# EAGLE schematic ESC_NoPilot (EAGLE 6.2)
AUTHOR: Kjell H Andersen; PROJECT_NAME: NoPilot; REVISION: 1.0

## Sheet 1 of 3
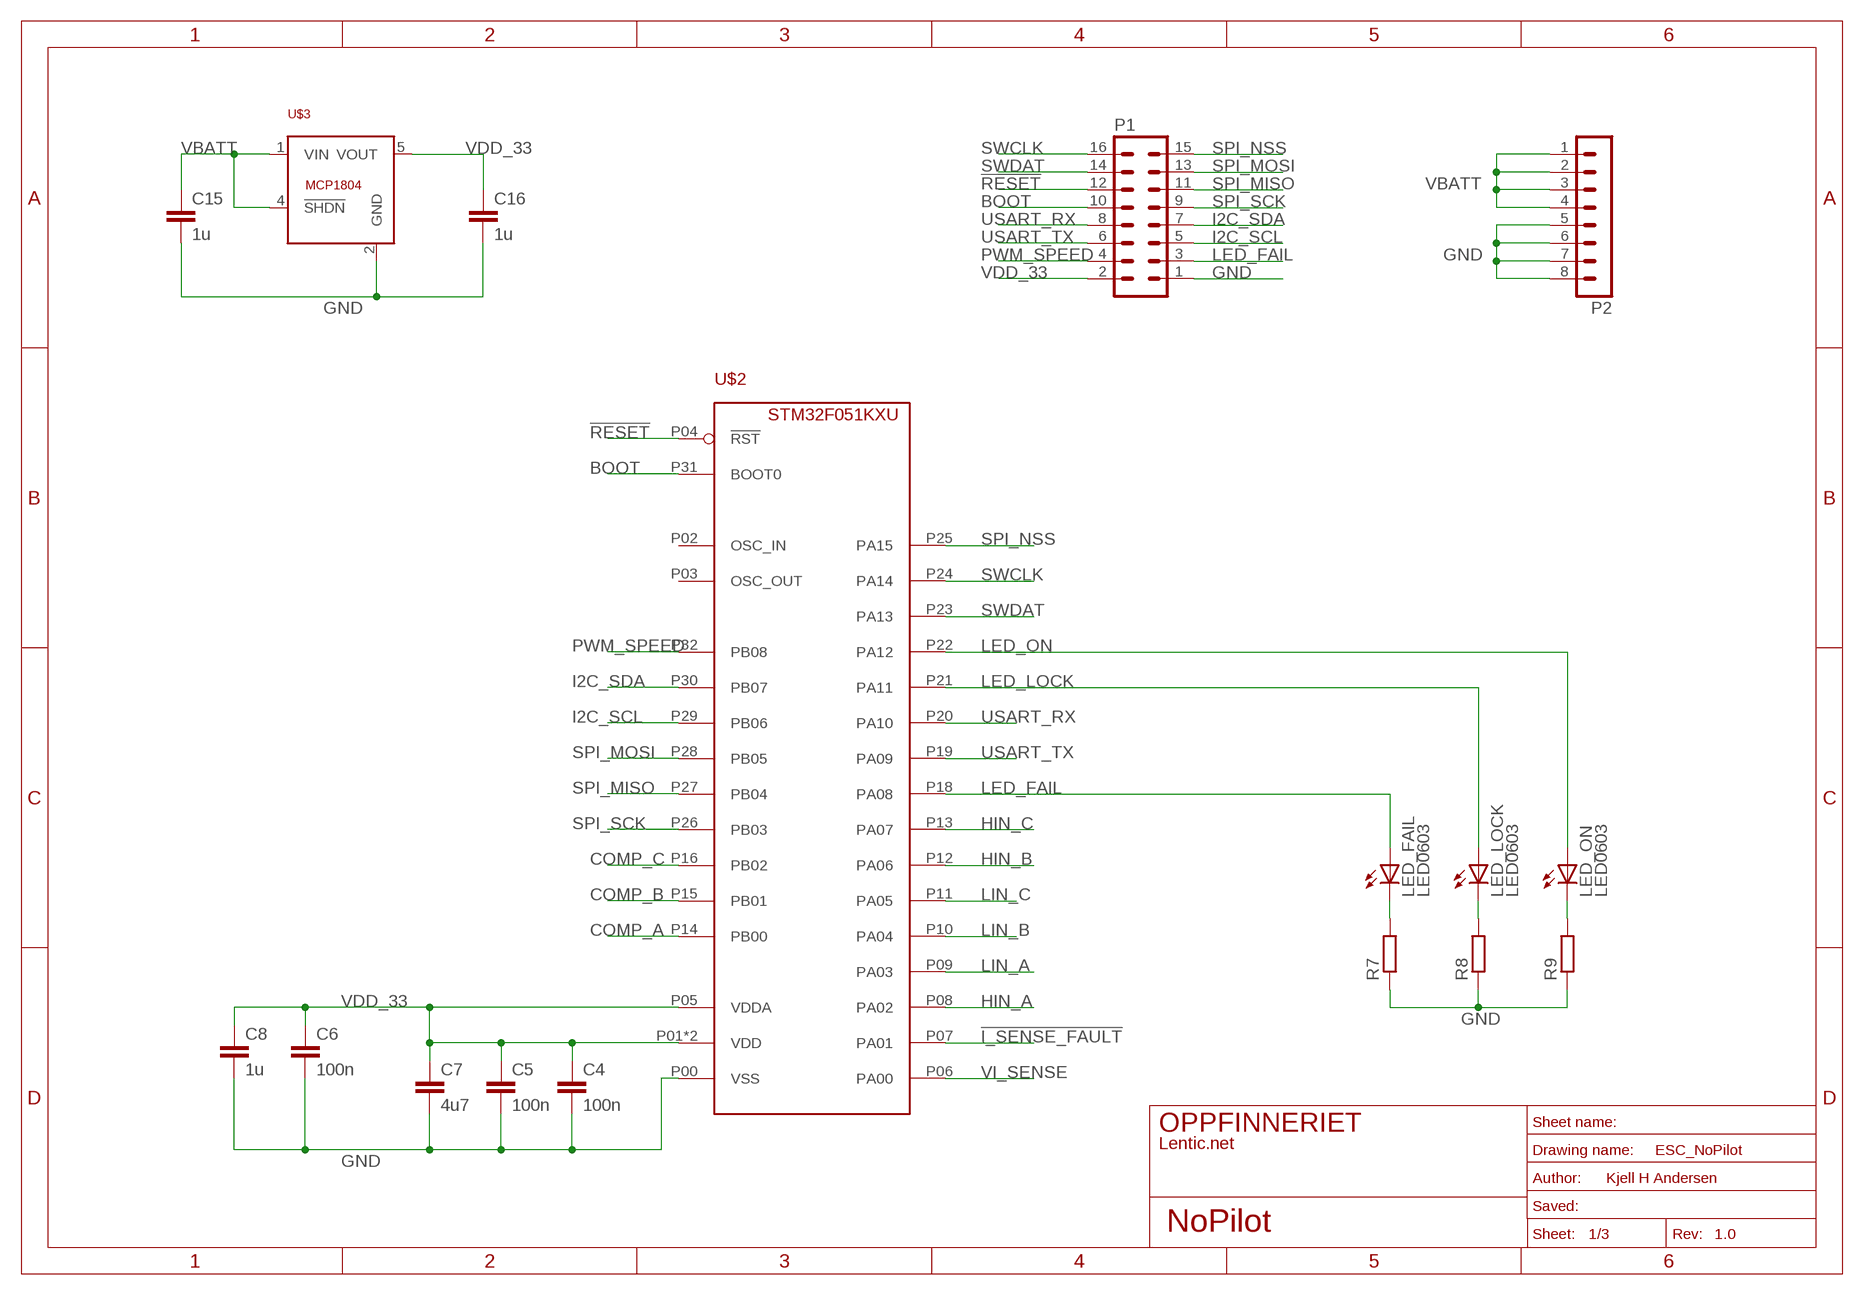
[diagram p0: schematic, sheet 1]
U$1 (A4_L): SHEET_NAME: MCU

### Parts
C4  100n  C-EUC0402  [C0402]
C5  100n  C-EUC0402  [C0402]
C6  100n  C-EUC0402  [C0402]
C7  4u7  C-EUC0805  [C0805]
C8  1u  C-EUC0805  [C0805]
C15  1u  C-EUC0805  [C0805]
C16  1u  C-EUC0805  [C0805]
LED_FAIL  LED0603  [D0603]
LED_LOCK  LED0603  [D0603]
LED_ON  LED0603  [D0603]
P1  MA08-2  [MA08-2]
P2  MA08-1  [MA08-1]
R7  R-EU_R0402  [R0402]
R8  R-EU_R0402  [R0402]
R9  R-EU_R0402  [R0402]
U$2  STM32F051KXU  [UFQFPN32]
U$3  MCP1804  [SOT23]

### Nets
!I_SENSE_FAULT: U$2.P07(PA01) ; also sheet 3
!RESET: P1.12 U$2.P04(!RST)
BOOT: P1.10 U$2.P31(BOOT0)
COMP_A: U$2.P14(PB00) ; also sheet 3
COMP_B: U$2.P15(PB01) ; also sheet 3
COMP_C: U$2.P16(PB02) ; also sheet 3
GND: C4.2 C5.2 C6.2 C7.2 C8.2 C15.2 C16.2 P1.1 P2.5 P2.6 P2.7 P2.8 R7.1 R8.1 R9.1 U$2.P00(VSS) U$3.2(GND) ; also sheet 2,3
HIN_A: U$2.P08(PA02) ; also sheet 2
HIN_B: U$2.P12(PA06) ; also sheet 2
HIN_C: U$2.P13(PA07) ; also sheet 2
I2C_SCL: P1.5 U$2.P29(PB06)
I2C_SDA: P1.7 U$2.P30(PB07)
LED_FAIL: LED_FAIL.A P1.3 U$2.P18(PA08)
LED_LOCK: LED_LOCK.A U$2.P21(PA11)
LED_ON: LED_ON.A U$2.P22(PA12)
LIN_A: U$2.P09(PA03) ; also sheet 2
LIN_B: U$2.P10(PA04) ; also sheet 2
LIN_C: U$2.P11(PA05) ; also sheet 2
N$5: LED_FAIL.C R7.2
N$6: LED_LOCK.C R8.2
N$7: LED_ON.C R9.2
PWM_SPEED: P1.4 U$2.P32(PB08)
SPI_MISO: P1.11 U$2.P27(PB04)
SPI_MOSI: P1.13 U$2.P28(PB05)
SPI_NSS: P1.15 U$2.P25(PA15)
SPI_SCK: P1.9 U$2.P26(PB03)
SWCLK: P1.16 U$2.P24(PA14)
SWDAT: P1.14 U$2.P23(PA13)
USART_RX: P1.8 U$2.P20(PA10)
USART_TX: P1.6 U$2.P19(PA09)
VBATT: C15.1 P2.1 P2.2 P2.3 P2.4 U$3.1(VIN) U$3.4(!SHDN) ; also sheet 2,3
VDD_33: C4.1 C5.1 C6.1 C7.1 C8.1 C16.1 P1.2 U$2.P01(VDD) U$2.P05(VDDA) U$2.P17(VDD) U$3.5(VOUT) ; also sheet 3
VI_SENSE: U$2.P06(PA00) ; also sheet 3
Unconnected: U$2.P02(OSC_IN) U$2.P03(OSC_OUT)

## Sheet 2 of 3
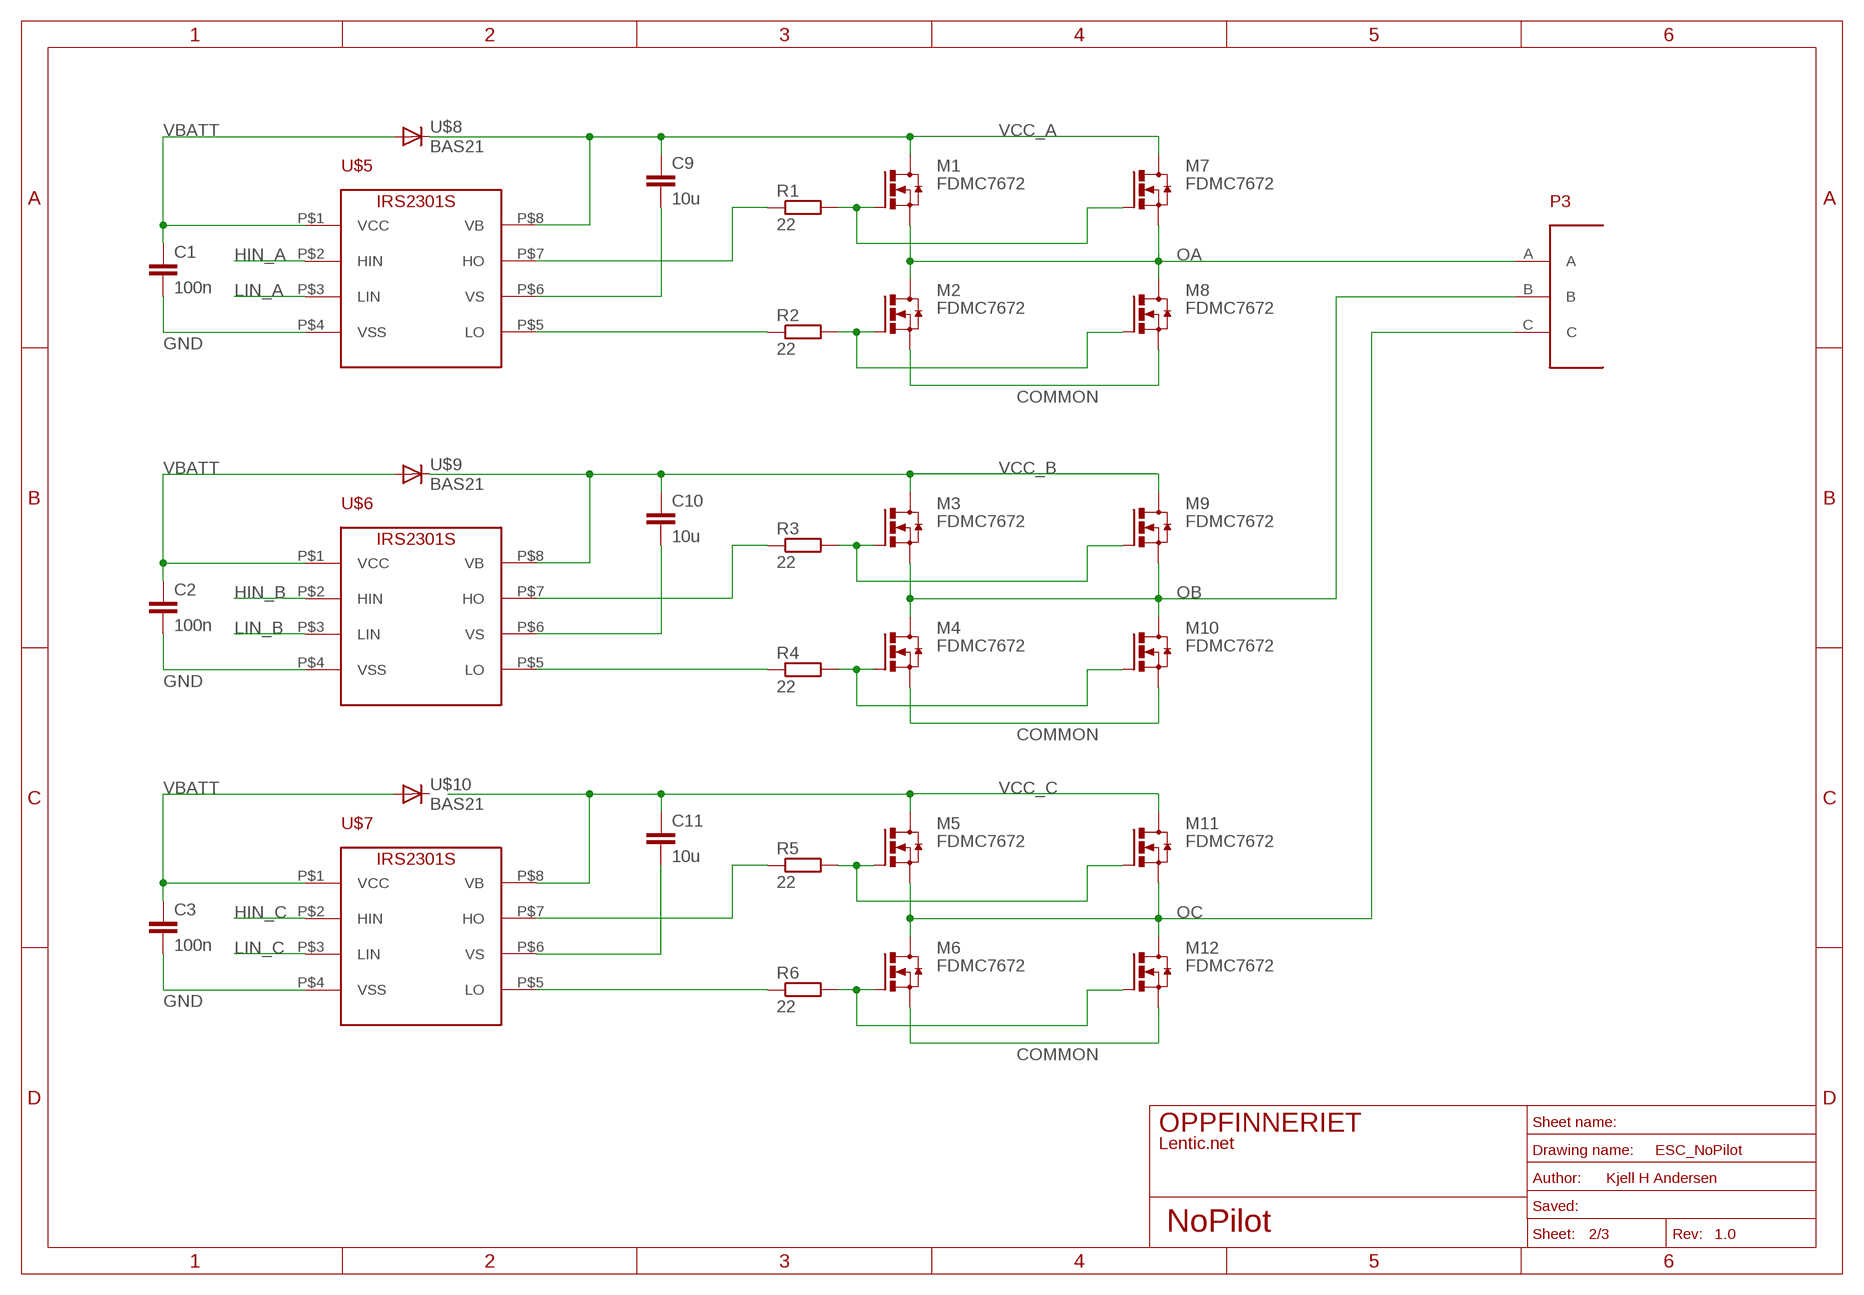
[diagram p1: schematic, sheet 2]
U$4 (A4_L): SHEET_NAME: Driver

### Parts
C1  100n  C-EUC0402  [C0402]
C2  100n  C-EUC0402  [C0402]
C3  100n  C-EUC0402  [C0402]
C9  10u  C-EUC0805  [C0805]
C10  10u  C-EUC0805  [C0805]
C11  10u  C-EUC0805  [C0805]
M1  FDMC7672  [MLP_3P3X3P3]
M2  FDMC7672  [MLP_3P3X3P3]
M3  FDMC7672  [MLP_3P3X3P3]
M4  FDMC7672  [MLP_3P3X3P3]
M5  FDMC7672  [MLP_3P3X3P3]
M6  FDMC7672  [MLP_3P3X3P3]
M7  FDMC7672  [MLP_3P3X3P3]
M8  FDMC7672  [MLP_3P3X3P3]
M9  FDMC7672  [MLP_3P3X3P3]
M10  FDMC7672  [MLP_3P3X3P3]
M11  FDMC7672  [MLP_3P3X3P3]
M12  FDMC7672  [MLP_3P3X3P3]
P3  3PH_SJ  [3PH_SJ]
R1  22  R-EU_R0402  [R0402]
R2  22  R-EU_R0402  [R0402]
R3  22  R-EU_R0402  [R0402]
R4  22  R-EU_R0402  [R0402]
R5  22  R-EU_R0402  [R0402]
R6  22  R-EU_R0402  [R0402]
U$5  IRS2301S  [SOIC8]
U$6  IRS2301S  [SOIC8]
U$7  IRS2301S  [SOIC8]
U$8  BAS21  [SOT23-3]
U$9  BAS21  [SOT23-3]
U$10  BAS21  [SOT23-3]

### Nets
COMMON: M2.P1(S) M2.P2(S) M2.P3(S) M4.P1(S) M4.P2(S) M4.P3(S) M6.P1(S) M6.P2(S) M6.P3(S) M8.P1(S) M8.P2(S) M8.P3(S) M10.P1(S) M10.P2(S) M10.P3(S) M12.P1(S) M12.P2(S) M12.P3(S) ; also sheet 3
GND: C1.2 C2.2 C3.2 U$5.P$4(VSS) U$6.P$4(VSS) U$7.P$4(VSS) ; also sheet 1,3
HIN_A: U$5.P$2(HIN) ; also sheet 1
HIN_B: U$6.P$2(HIN) ; also sheet 1
HIN_C: U$7.P$2(HIN) ; also sheet 1
LIN_A: U$5.P$3(LIN) ; also sheet 1
LIN_B: U$6.P$3(LIN) ; also sheet 1
LIN_C: U$7.P$3(LIN) ; also sheet 1
M1: M1.P4(G) M7.P4(G) R1.2
M4: M4.P4(G) M10.P4(G) R4.2
N$14: C9.2 U$5.P$6(VS)
N$16: R1.1 U$5.P$7(HO)
N$18: M2.P4(G) M8.P4(G) R2.2
N$19: R2.1 U$5.P$5(LO)
N$22: C10.2 U$6.P$6(VS)
N$23: M3.P4(G) M9.P4(G) R3.2
N$24: R3.1 U$6.P$7(HO)
N$27: R4.1 U$6.P$5(LO)
N$29: C11.2 U$7.P$6(VS)
N$30: R5.1 U$7.P$7(HO)
N$31: M5.P4(G) M11.P4(G) R5.2
N$33: M6.P4(G) M12.P4(G) R6.2
N$34: R6.1 U$7.P$5(LO)
OA: M1.P1(S) M1.P2(S) M1.P3(S) M2.P0(D) M2.P5(D) M2.P6(D) M2.P7(D) M2.P8(D) M7.P1(S) M7.P2(S) M7.P3(S) M8.P0(D) M8.P5(D) M8.P6(D) M8.P7(D) M8.P8(D) P3.A ; also sheet 3
OB: M3.P1(S) M3.P2(S) M3.P3(S) M4.P0(D) M4.P5(D) M4.P6(D) M4.P7(D) M4.P8(D) M9.P1(S) M9.P2(S) M9.P3(S) M10.P0(D) M10.P5(D) M10.P6(D) M10.P7(D) M10.P8(D) P3.B ; also sheet 3
OC: M5.P1(S) M5.P2(S) M5.P3(S) M6.P0(D) M6.P5(D) M6.P6(D) M6.P7(D) M6.P8(D) M11.P1(S) M11.P2(S) M11.P3(S) M12.P0(D) M12.P5(D) M12.P6(D) M12.P7(D) M12.P8(D) P3.C ; also sheet 3
VBATT: C1.1 C2.1 C3.1 U$5.P$1(VCC) U$6.P$1(VCC) U$7.P$1(VCC) U$8.P1(A) U$9.P1(A) U$10.P1(A) ; also sheet 1,3
VCC_A: C9.1 M1.P0(D) M1.P5(D) M1.P6(D) M1.P7(D) M1.P8(D) M7.P0(D) M7.P5(D) M7.P6(D) M7.P7(D) M7.P8(D) U$5.P$8(VB) U$8.P3(C)
VCC_B: C10.1 M3.P0(D) M3.P5(D) M3.P6(D) M3.P7(D) M3.P8(D) M9.P0(D) M9.P5(D) M9.P6(D) M9.P7(D) M9.P8(D) U$6.P$8(VB) U$9.P3(C)
VCC_C: C11.1 M5.P0(D) M5.P5(D) M5.P6(D) M5.P7(D) M5.P8(D) M11.P0(D) M11.P5(D) M11.P6(D) M11.P7(D) M11.P8(D) U$7.P$8(VB)
Unconnected: U$10.P3(C)

## Sheet 3 of 3
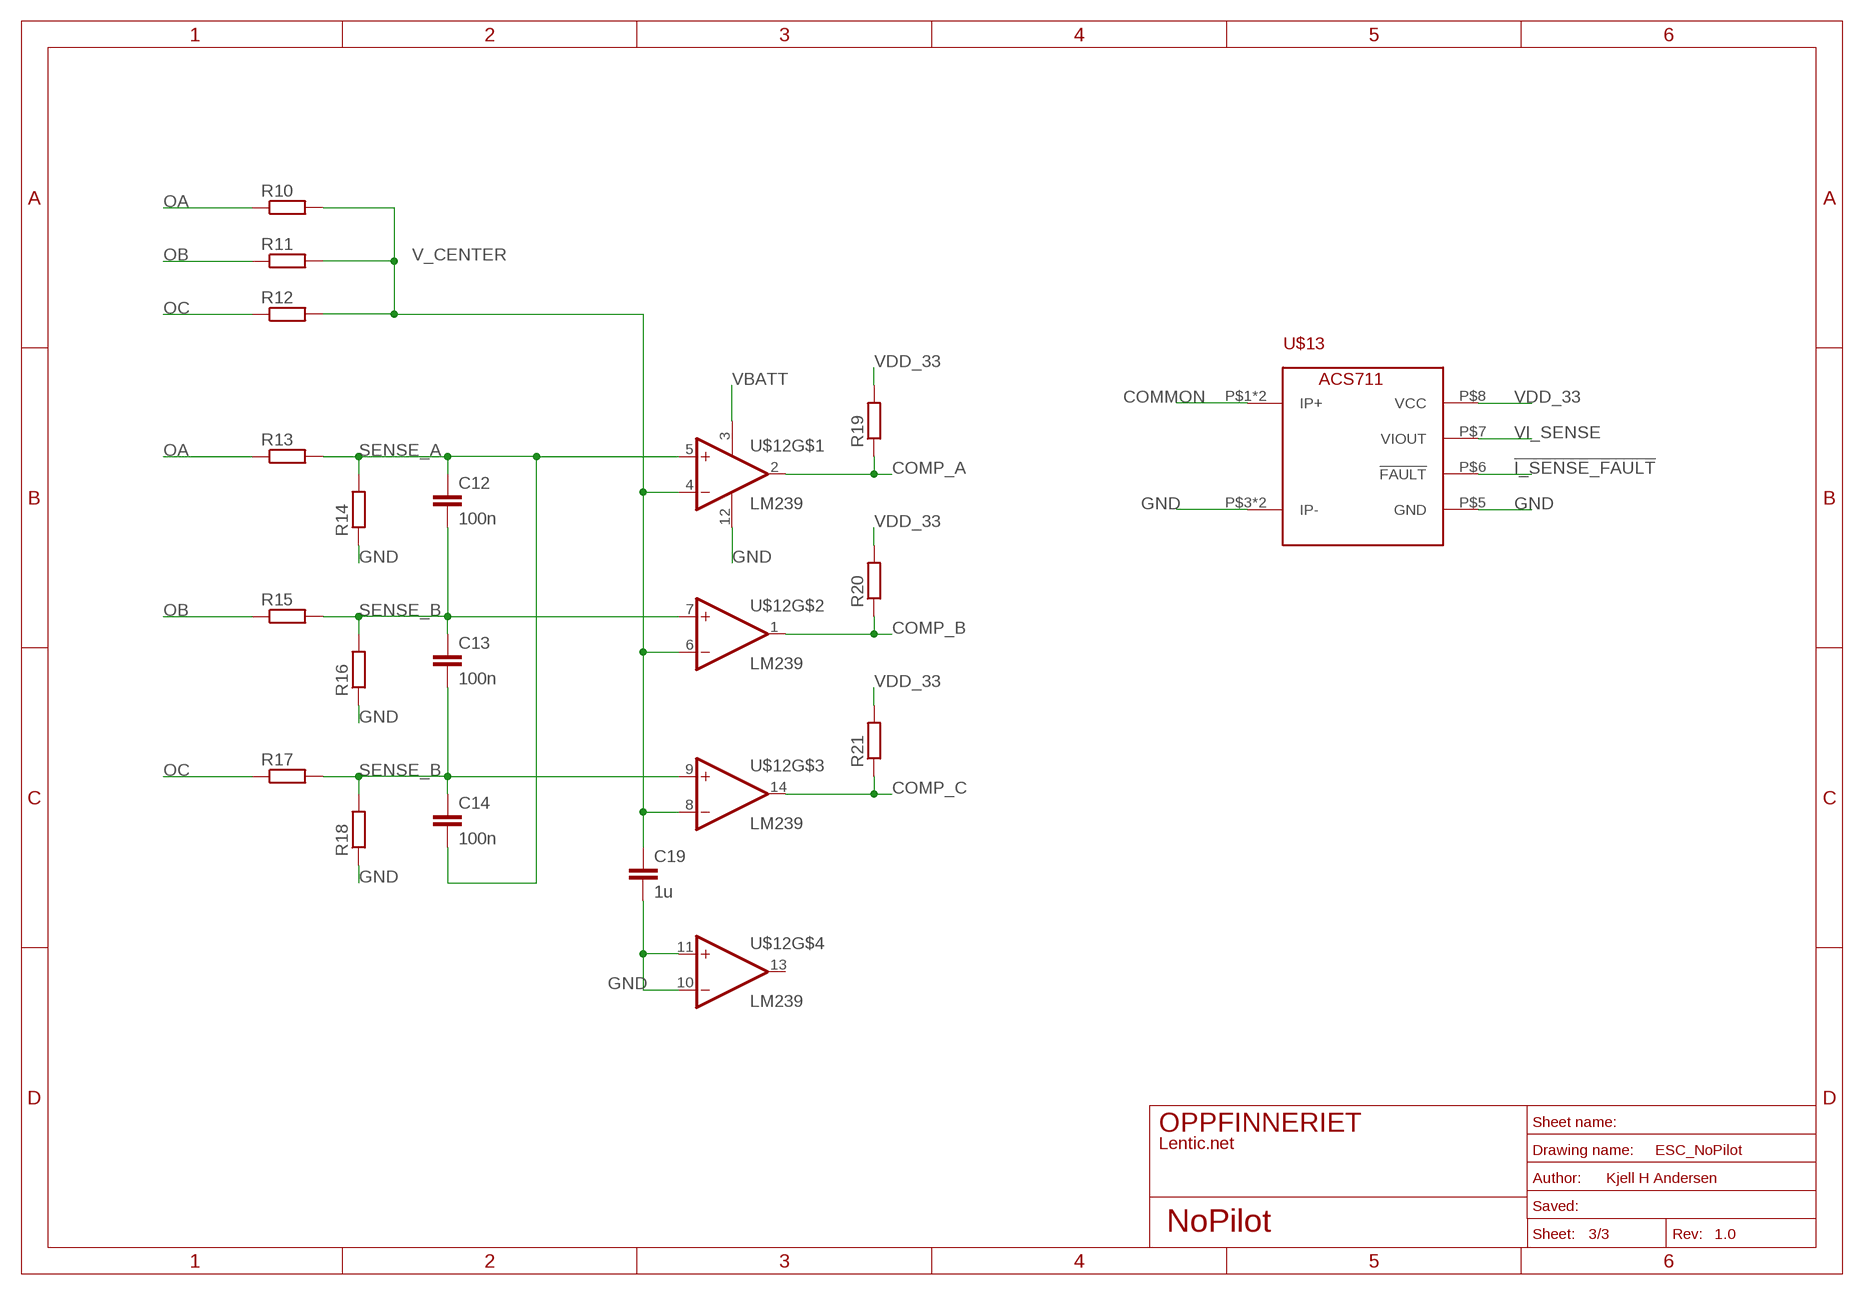
[diagram p2: schematic, sheet 3]
U$11 (A4_L): SHEET_NAME: Sense

### Parts
C12  100n  C-EUC0402  [C0402]
C13  100n  C-EUC0402  [C0402]
C14  100n  C-EUC0402  [C0402]
C19  1u  C-EUC0805  [C0805]
R10  R-EU_R0402  [R0402]
R11  R-EU_R0402  [R0402]
R12  R-EU_R0402  [R0402]
R13  R-EU_R0402  [R0402]
R14  R-EU_R0402  [R0402]
R15  R-EU_R0402  [R0402]
R16  R-EU_R0402  [R0402]
R17  R-EU_R0402  [R0402]
R18  R-EU_R0402  [R0402]
R19  R-EU_R0402  [R0402]
R20  R-EU_R0402  [R0402]
R21  R-EU_R0402  [R0402]
U$12  LM239  [TSSOP14]
U$13  ACS711  [SOIC8]

### Nets
!I_SENSE_FAULT: U$13.P$6(!FAULT) ; also sheet 1
COMMON: U$13.P$1(IP+) U$13.P$2(IP+) ; also sheet 2
COMP_A: R19.1 U$12.2(OUT) ; also sheet 1
COMP_B: R20.1 U$12.1(OUT) ; also sheet 1
COMP_C: R21.1 U$12.14(OUT) ; also sheet 1
GND: C19.2 R14.1 R16.1 R18.1 U$12.10(-IN) U$12.11(+IN) U$12.12(GND) U$13.P$3(IP-) U$13.P$4(IP-) U$13.P$5(GND) ; also sheet 1,2
OA: R10.1 R13.1 ; also sheet 2
OB: R11.1 R15.1 ; also sheet 2
OC: R12.1 R17.1 ; also sheet 2
SENSE_A: C12.1 C14.2 R13.2 R14.2 U$12.5(+IN)
SENSE_B: C12.2 C13.1 C13.2 C14.1 R15.2 R16.2 R17.2 R18.2 U$12.7(+IN) U$12.9(+IN)
V_CENTER: C19.1 R10.2 R11.2 R12.2 U$12.4(-IN) U$12.6(-IN) U$12.8(-IN)
VBATT: U$12.3(V+) ; also sheet 1,2
VDD_33: R19.2 R20.2 R21.2 U$13.P$8(VCC) ; also sheet 1
VI_SENSE: U$13.P$7(VIOUT) ; also sheet 1
Unconnected: U$12.13(OUT)

## Library data of the parts
C1-C16 C19 = resistor:C-EU: CAPACITOR, European symbol
LED_FAIL LED_LOCK LED_ON = misc_devices:LED0603
M1-M12 = misc_devices:FDMC7672
P1 = con-lstb:MA08-2: PIN HEADER; OC_FARNELL: unknown; OC_NEWARK: unknown
P2 = con-lstb:MA08-1: PIN HEADER; OC_FARNELL: unknown; OC_NEWARK: unknown
P3 = connectors:3PH_SJ
R1-R21 = resistor:R-EU_: RESISTOR, European symbol
U$2 = stm32:STM32F051KXU
U$3 = misc_devices:MCP1804
U$5-U$7 = misc_devices:IRS2301S
U$8-U$10 = misc_devices:BAS21
U$12 = misc_devices:LM239
U$13 = misc_devices:ACS711